# EAGLE schematic untitled (EAGLE 9.6.2)
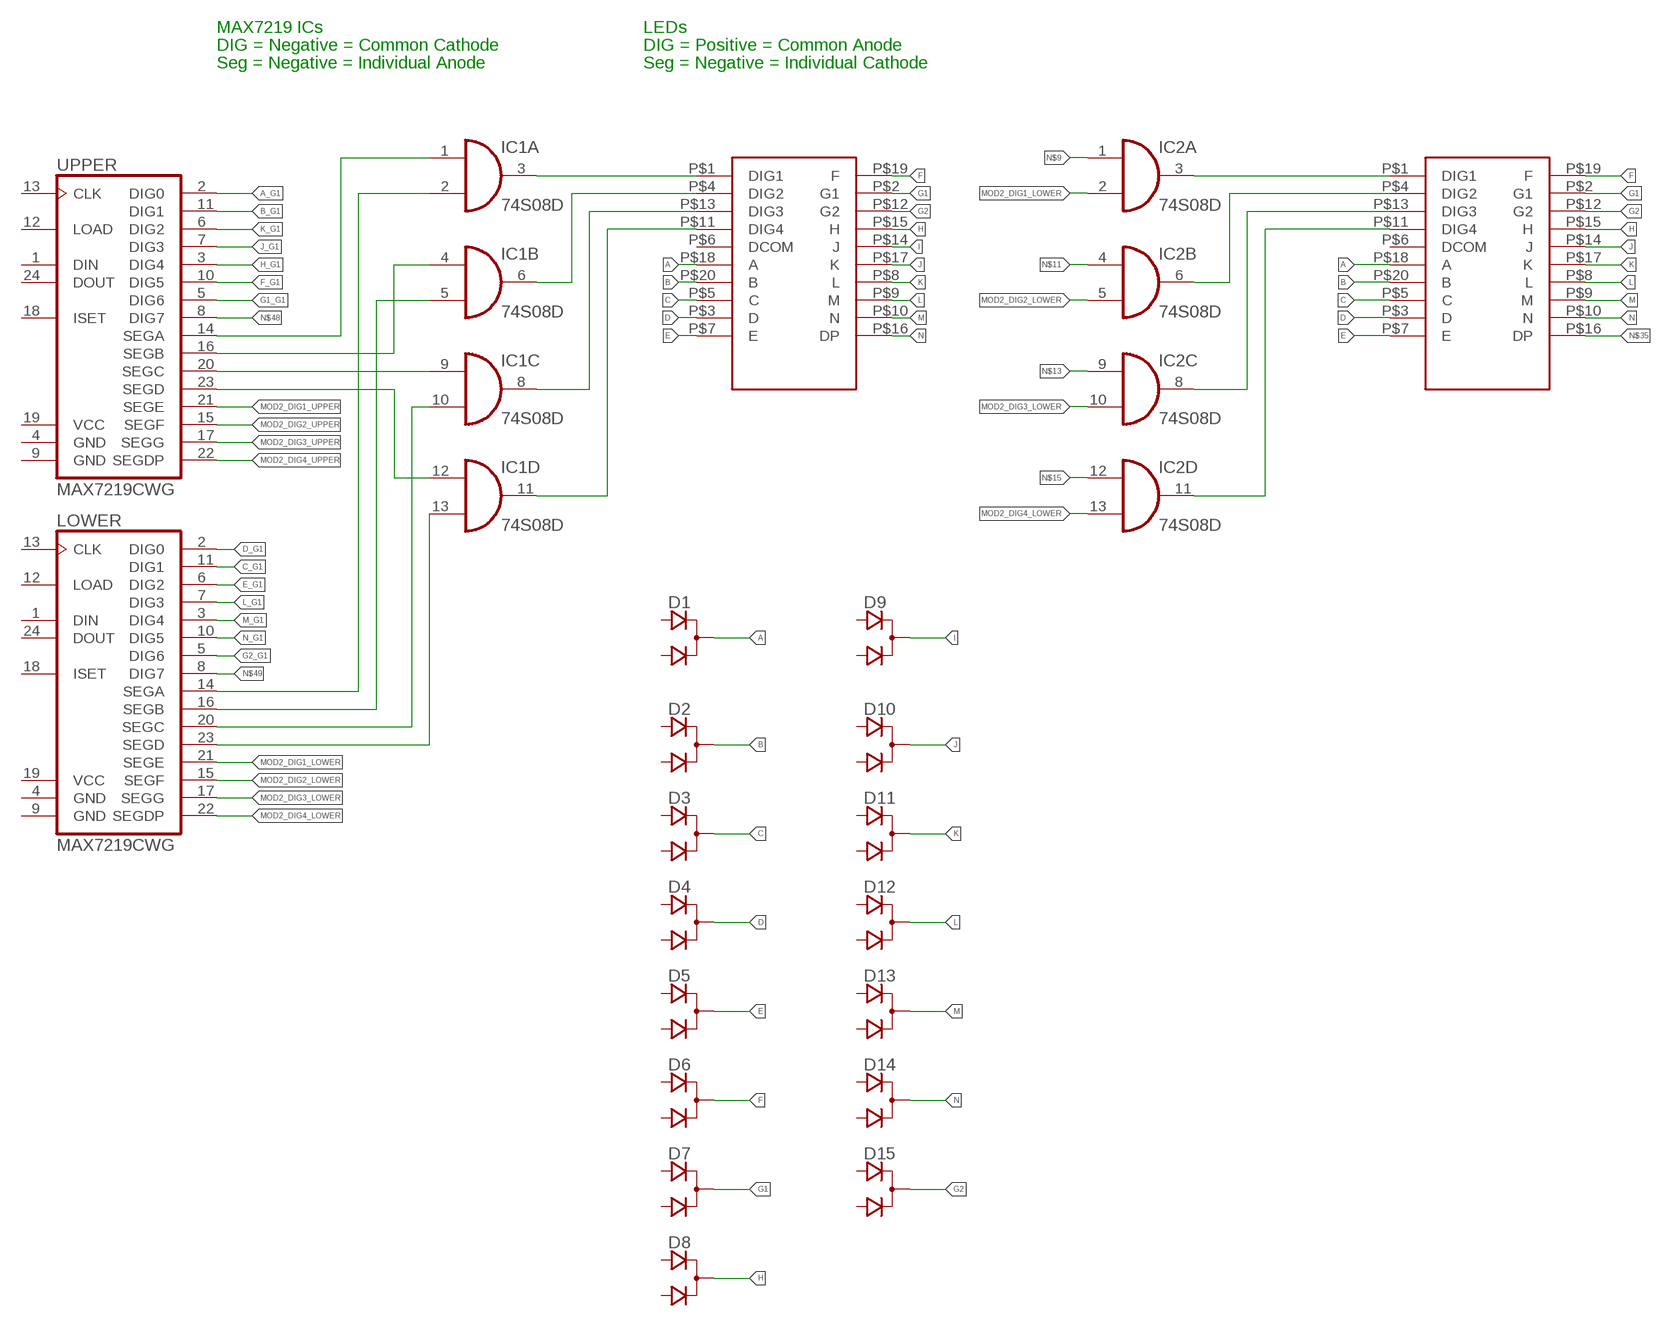
[diagram p0: schematic, sheet 1]

## Parts
D1  D_2ASOT23  [SOT-23]
D2  D_2ASOT23  [SOT-23]
D3  D_2ASOT23  [SOT-23]
D4  D_2ASOT23  [SOT-23]
D5  D_2ASOT23  [SOT-23]
D6  D_2ASOT23  [SOT-23]
D7  D_2ASOT23  [SOT-23]
D8  D_2ASOT23  [SOT-23]
D9  D_2ASOT23  [SOT-23]
D10  D_2ASOT23  [SOT-23]
D11  D_2ASOT23  [SOT-23]
D12  D_2ASOT23  [SOT-23]
D13  D_2ASOT23  [SOT-23]
D14  D_2ASOT23  [SOT-23]
D15  D_2ASOT23  [SOT-23]
IC1  74S08D  [SO14]
IC2  74S08D  [SO14]
LOWER  MAX7219CWG  [SO24L]
U$2  16SEG-LED  [16SEG-LED]
U$3  16SEG-LED  [16SEG-LED]
UPPER  MAX7219CWG  [SO24L]

## Nets
A: D1.1(C) U$2.P$18(A) U$3.P$18(A)
A_G1: UPPER.2(DIG0)
B: D2.1(C) U$2.P$20(B) U$3.P$20(B)
B_G1: UPPER.11(DIG1)
C: D3.1(C) U$2.P$5(C) U$3.P$5(C)
C_G1: LOWER.11(DIG1)
D: D4.1(C) U$2.P$3(D) U$3.P$3(D)
D_G1: LOWER.2(DIG0)
E: D5.1(C) U$2.P$7(E) U$3.P$7(E)
E_G1: LOWER.6(DIG2)
F: D6.1(C) U$2.P$19(F) U$3.P$19(F)
F_G1: UPPER.10(DIG5)
G1: D7.1(C) U$2.P$2(G1) U$3.P$2(G1)
G1_G1: UPPER.5(DIG6)
G2: D15.1(C) U$2.P$12(G2) U$3.P$12(G2)
G2_G1: LOWER.5(DIG6)
H: D8.1(C) U$2.P$15(H) U$3.P$15(H)
H_G1: UPPER.3(DIG4)
I: D9.1(C) U$2.P$14(J)
J: D10.1(C) U$2.P$17(K) U$3.P$14(J)
J_G1: UPPER.7(DIG3)
K: D11.1(C) U$2.P$8(L) U$3.P$17(K)
K_G1: UPPER.6(DIG2)
L: D12.1(C) U$2.P$9(M) U$3.P$8(L)
L_G1: LOWER.7(DIG3)
M: D13.1(C) U$2.P$10(N) U$3.P$9(M)
M_G1: LOWER.3(DIG4)
MOD2_DIG1_LOWER: IC2.2(A:I1) LOWER.21(SEGE)
MOD2_DIG1_UPPER: UPPER.21(SEGE)
MOD2_DIG2_LOWER: IC2.5(B:I1) LOWER.15(SEGF)
MOD2_DIG2_UPPER: UPPER.15(SEGF)
MOD2_DIG3_LOWER: IC2.10(C:I1) LOWER.17(SEGG)
MOD2_DIG3_UPPER: UPPER.17(SEGG)
MOD2_DIG4_LOWER: IC2.13(D:I1) LOWER.22(SEGDP)
MOD2_DIG4_UPPER: UPPER.22(SEGDP)
N: D14.1(C) U$2.P$16(DP) U$3.P$10(N)
N$1: IC1.3(A:O) U$2.P$1(DIG1)
N$2: IC1.6(B:O) U$2.P$4(DIG2)
N$3: IC1.8(C:O) U$2.P$13(DIG3)
N$4: IC2.3(A:O) U$3.P$1(DIG1)
N$5: IC2.6(B:O) U$3.P$4(DIG2)
N$6: IC2.8(C:O) U$3.P$13(DIG3)
N$7: IC2.11(D:O) U$3.P$11(DIG4)
N$8: IC1.1(A:I0) UPPER.14(SEGA)
N$9: IC2.1(A:I0)
N$11: IC2.4(B:I0)
N$13: IC2.9(C:I0)
N$15: IC2.12(D:I0)
N$25: IC1.11(D:O) U$2.P$11(DIG4)
N$26: IC1.4(B:I0) UPPER.16(SEGB)
N$27: IC1.9(C:I0) UPPER.20(SEGC)
N$28: IC1.12(D:I0) UPPER.23(SEGD)
N$29: IC1.2(A:I1) LOWER.14(SEGA)
N$30: IC1.5(B:I1) LOWER.16(SEGB)
N$31: IC1.10(C:I1) LOWER.20(SEGC)
N$32: IC1.13(D:I1) LOWER.23(SEGD)
N$35: U$3.P$16(DP)
N$48: UPPER.8(DIG7)
N$49: LOWER.8(DIG7)
N_G1: LOWER.10(DIG5)
Unconnected: D1.2(A1) D1.3(A2) D2.2(A1) D2.3(A2) D3.2(A1) D3.3(A2) D4.2(A1) D4.3(A2) D5.2(A1) D5.3(A2) D6.2(A1) D6.3(A2) D7.2(A1) D7.3(A2) D8.2(A1) D8.3(A2) D9.2(A1) D9.3(A2) D10.2(A1) D10.3(A2) D11.2(A1) D11.3(A2) D12.2(A1) D12.3(A2) D13.2(A1) D13.3(A2) D14.2(A1) D14.3(A2) D15.2(A1) D15.3(A2) LOWER.1(DIN) LOWER.12(LOAD) LOWER.13(CLK) LOWER.18(ISET) LOWER.24(DOUT) U$2.P$6(DCOM) U$3.P$6(DCOM) UPPER.1(DIN) UPPER.12(LOAD) UPPER.13(CLK) UPPER.18(ISET) UPPER.24(DOUT)

## Notes on the sheet
- MAX7219 ICs | LEDs
- DIG = Negative = Common Cathode | DIG = Positive = Common Anode
- Seg = Negative = Individual Anode | Seg = Negative = Individual Cathode

## Power pins joined to a net without a drawn wire
GND: IC1.7(P:GND) IC2.7(P:GND) LOWER.4(GND) LOWER.9(GND) UPPER.4(GND) UPPER.9(GND)
VCC: IC1.14(P:VCC) IC2.14(P:VCC) LOWER.19(VCC) UPPER.19(VCC)

## Library data of the parts
D1-D15 = zetex:D_2A: Dual DIODE; OC_FARNELL: unknown; OC_NEWARK: unknown
IC1 IC2 = 74xx-eu:74*08: Quad 2-input AND gate
LOWER UPPER = max7219:MAX7219CWG
U$2 U$3 = HustleLib:16SEG-LED